# Altium schematic sheet ASIC_test_fanout.SchDoc
size A3; SheetNumber: 1; SheetTotal: 1
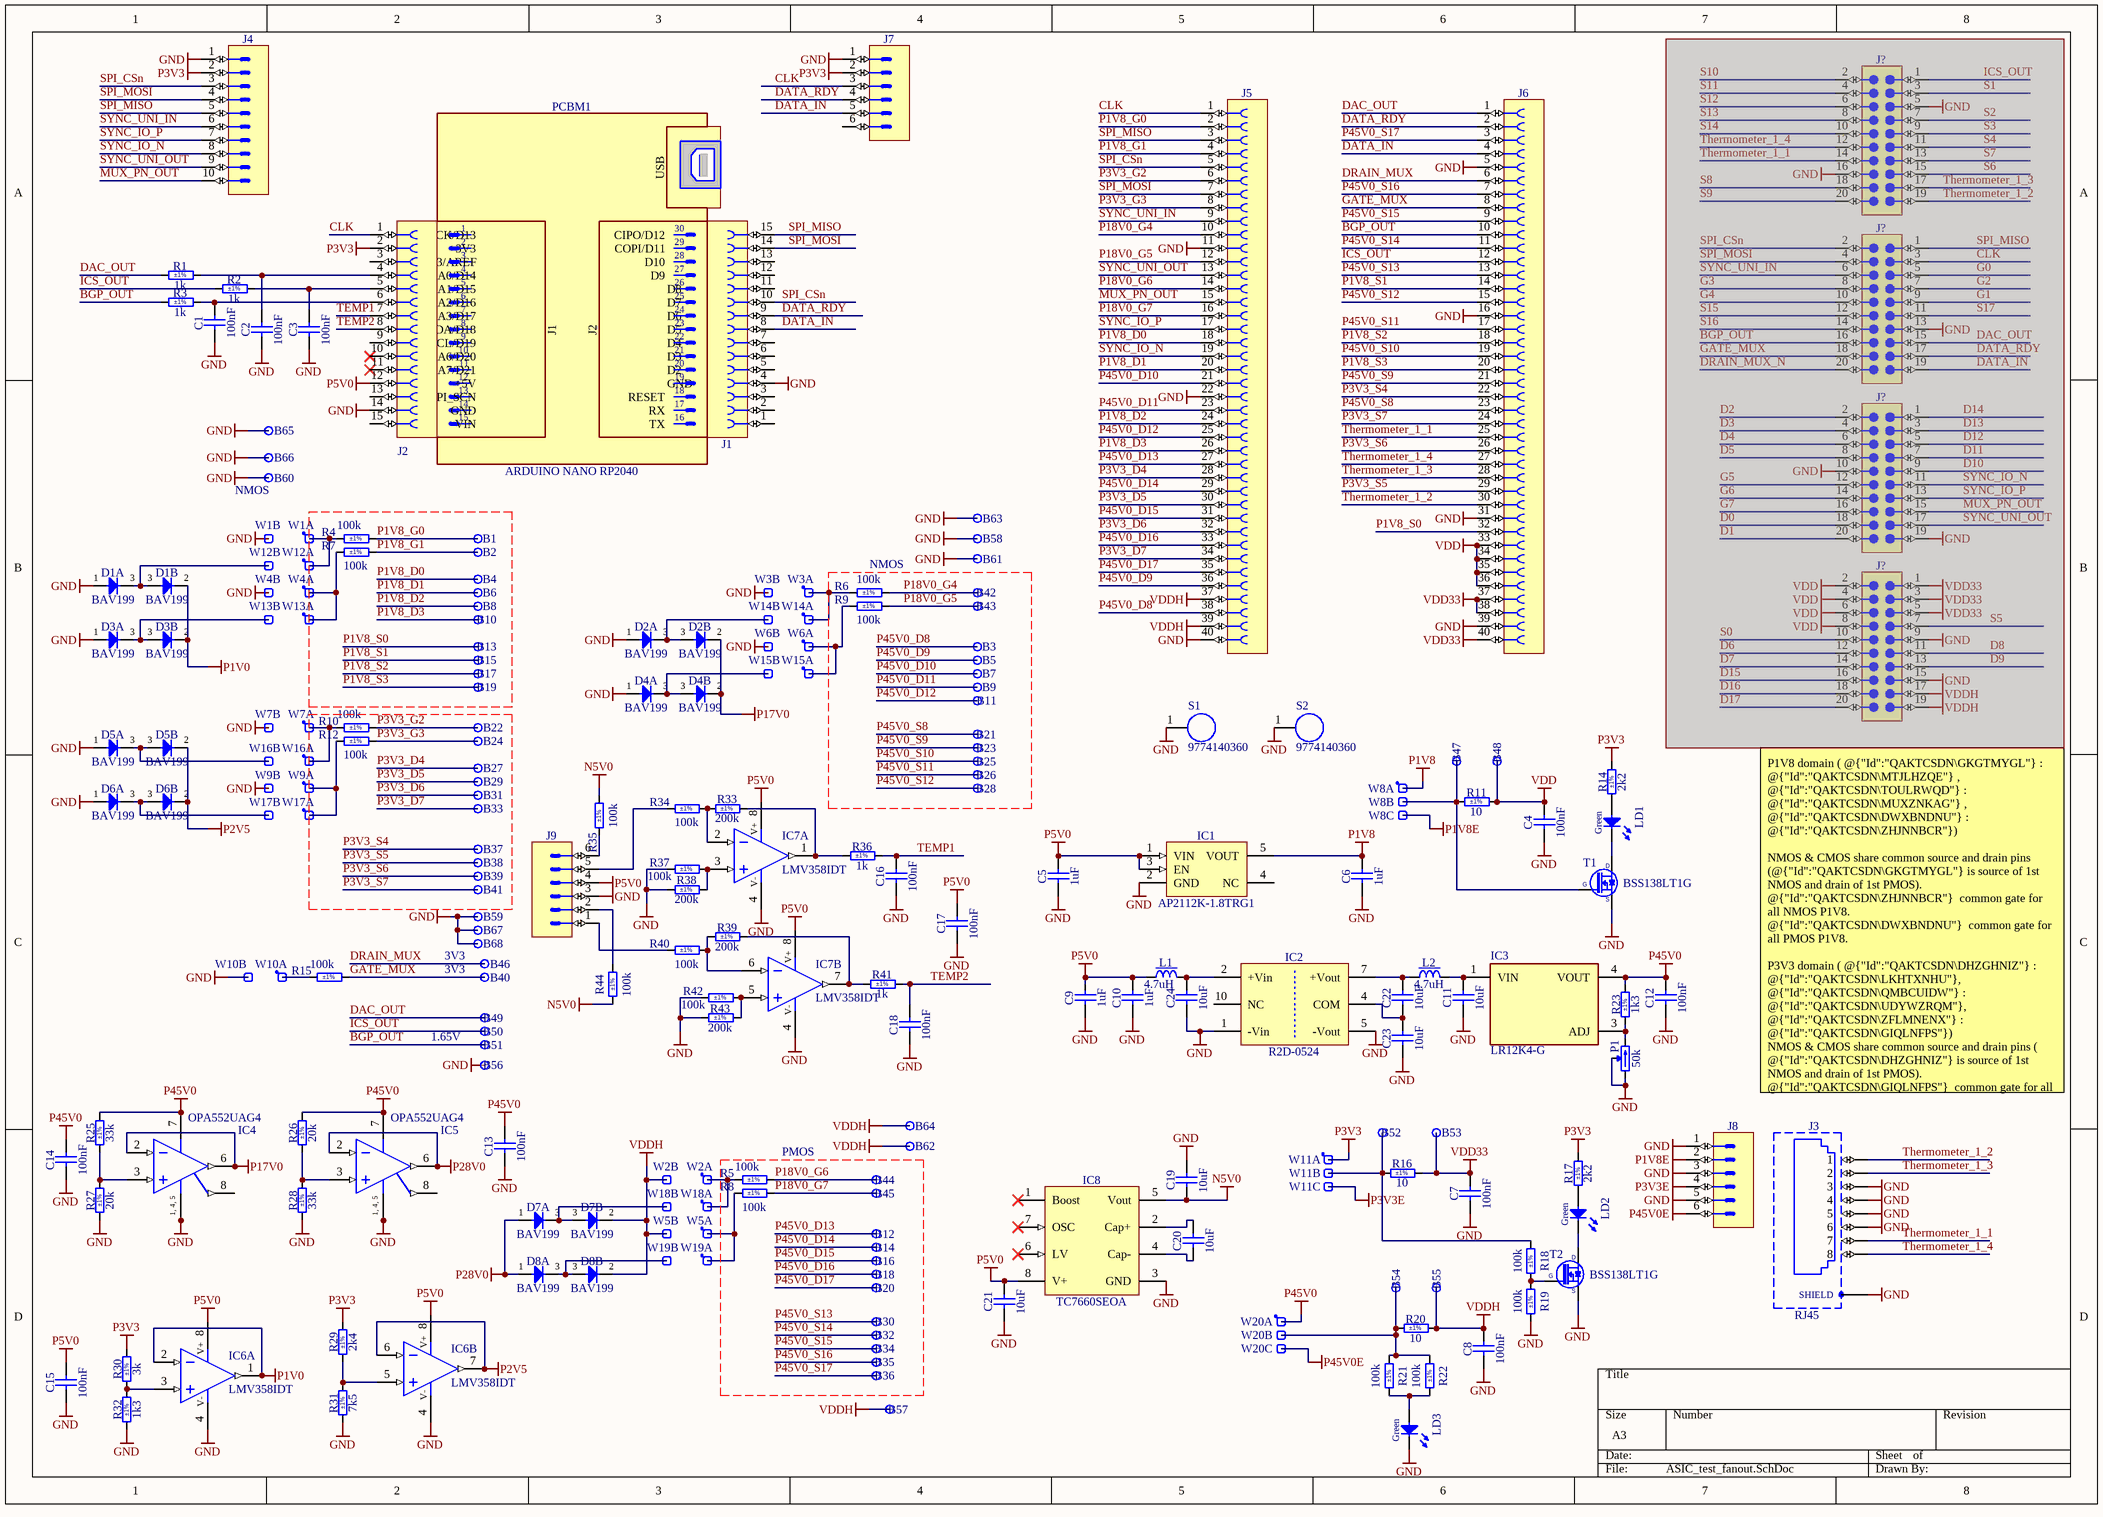
[diagram p0: ASIC_test_fanout.SchDoc]

## Parts
(Parts that share a designator on the sheet are numbered #1, #2 ... from top to bottom, then left to right.)
B1  Socket  [MULTI-CONTACT_23.1000]  (value not drawn)
B2  Socket  [MULTI-CONTACT_23.1000]  (value not drawn)
B3  Socket  [MULTI-CONTACT_23.1000]  (value not drawn)
B4  Socket  [MULTI-CONTACT_23.1000]  (value not drawn)
B5  Socket  [MULTI-CONTACT_23.1000]  (value not drawn)
B6  Socket  [MULTI-CONTACT_23.1000]  (value not drawn)
B7  Socket  [MULTI-CONTACT_23.1000]  (value not drawn)
B8  Socket  [MULTI-CONTACT_23.1000]  (value not drawn)
B9  Socket  [MULTI-CONTACT_23.1000]  (value not drawn)
B10  Socket  [MULTI-CONTACT_23.1000]  (value not drawn)
B11  Socket  [MULTI-CONTACT_23.1000]  (value not drawn)
B12  Socket  [MULTI-CONTACT_23.1000]  (value not drawn)
B13  Socket  [MULTI-CONTACT_23.1000]  (value not drawn)
B14  Socket  [MULTI-CONTACT_23.1000]  (value not drawn)
B15  Socket  [MULTI-CONTACT_23.1000]  (value not drawn)
B16  Socket  [MULTI-CONTACT_23.1000]  (value not drawn)
B17  Socket  [MULTI-CONTACT_23.1000]  (value not drawn)
B18  Socket  [MULTI-CONTACT_23.1000]  (value not drawn)
B19  Socket  [MULTI-CONTACT_23.1000]  (value not drawn)
B20  Socket  [MULTI-CONTACT_23.1000]  (value not drawn)
B21  Socket  [MULTI-CONTACT_23.1000]  (value not drawn)
B22  Socket  [MULTI-CONTACT_23.1000]  (value not drawn)
B23  Socket  [MULTI-CONTACT_23.1000]  (value not drawn)
B24  Socket  [MULTI-CONTACT_23.1000]  (value not drawn)
B25  Socket  [MULTI-CONTACT_23.1000]  (value not drawn)
B26  Socket  [MULTI-CONTACT_23.1000]  (value not drawn)
B27  Socket  [MULTI-CONTACT_23.1000]  (value not drawn)
B28  Socket  [MULTI-CONTACT_23.1000]  (value not drawn)
B29  Socket  [MULTI-CONTACT_23.1000]  (value not drawn)
B30  Socket  [MULTI-CONTACT_23.1000]  (value not drawn)
B31  Socket  [MULTI-CONTACT_23.1000]  (value not drawn)
B32  Socket  [MULTI-CONTACT_23.1000]  (value not drawn)
B33  Socket  [MULTI-CONTACT_23.1000]  (value not drawn)
B34  Socket  [MULTI-CONTACT_23.1000]  (value not drawn)
B35  Socket  [MULTI-CONTACT_23.1000]  (value not drawn)
B36  Socket  [MULTI-CONTACT_23.1000]  (value not drawn)
B37  Socket  [MULTI-CONTACT_23.1000]  (value not drawn)
B38  Socket  [MULTI-CONTACT_23.1000]  (value not drawn)
B39  Socket  [MULTI-CONTACT_23.1000]  (value not drawn)
B40  Socket  [MULTI-CONTACT_23.1000]  (value not drawn)
B41  Socket  [MULTI-CONTACT_23.1000]  (value not drawn)
B42  Socket  [MULTI-CONTACT_23.1000]  (value not drawn)
B43  Socket  [MULTI-CONTACT_23.1000]  (value not drawn)
B44  Socket  [MULTI-CONTACT_23.1000]  (value not drawn)
B45  Socket  [MULTI-CONTACT_23.1000]  (value not drawn)
B46  Socket  [MULTI-CONTACT_23.1000]  (value not drawn)
B47  Socket  [MULTI-CONTACT_23.1000]  (value not drawn)
B48  Socket  [MULTI-CONTACT_23.1000]  (value not drawn)
B49  Socket  [MULTI-CONTACT_23.1000]  (value not drawn)
B50  Socket  [MULTI-CONTACT_23.1000]  (value not drawn)
B51  Socket  [MULTI-CONTACT_23.1000]  (value not drawn)
B52  Socket  [MULTI-CONTACT_23.1000]  (value not drawn)
B53  Socket  [MULTI-CONTACT_23.1000]  (value not drawn)
B54  Socket  [MULTI-CONTACT_23.1000]  (value not drawn)
B55  Socket  [MULTI-CONTACT_23.1000]  (value not drawn)
B56  Socket  [MULTI-CONTACT_23.1000]  (value not drawn)
B57  Socket  [MULTI-CONTACT_23.1000]  (value not drawn)
B58  Socket  [MULTI-CONTACT_23.1000]  (value not drawn)
B59  Socket  [MULTI-CONTACT_23.1000]  (value not drawn)
B60  Socket  [MULTI-CONTACT_23.1000]  (value not drawn)
B61  Socket  [MULTI-CONTACT_23.1000]  (value not drawn)
B62  Socket  [MULTI-CONTACT_23.1000]  (value not drawn)
B63  Socket  [MULTI-CONTACT_23.1000]  (value not drawn)
B64  Socket  [MULTI-CONTACT_23.1000]  (value not drawn)
B65  Socket  [MULTI-CONTACT_23.1000]  (value not drawn)
B66  Socket  [MULTI-CONTACT_23.1000]  (value not drawn)
B67  Socket  [MULTI-CONTACT_23.1000]  (value not drawn)
B68  Socket  [MULTI-CONTACT_23.1000]  (value not drawn)
C1  100nF  [CAPC1608X87N]
C2  100nF  [CAPC1608X87N]
C3  100nF  [CAPC1608X87N]
C4  100nF  [CAPC1608X87N]
C5  1uF  [CAPC1608X87N]
C6  1uF  [CAPC1608X87N]
C7  100nF  [CAPC1608X87N]
C8  100nF  [CAPC1608X87N]
C9  1uF  [CAPC1608X87N]
C10  1uF  [CAPC1608X87N]
C11  10uF  [CAPC3216X180N]
C12  100nF  [CAPC1608X87N]
C13  100nF  [CAPC1608X87N]
C14  100nF  [CAPC1608X87N]
C15  100nF  [CAPC1608X87N]
C16  100nF  [CAPC1608X87N]
C17  100nF  [CAPC1608X87N]
C18  100nF  [CAPC1608X87N]
C19  10uF  [CAPC3216X180N]
C20  10uF  [CAPC3216X180N]
C21  10uF  [CAPC3216X180N]
C22  10uF  [CAPC3216X180N]
C23  10uF  [CAPC3216X180N]
C24  10uF  [CAPC3216X180N]
D1  BAV199  [SOT95P240X110-3N]  (parts A,B of 2)
D2  BAV199  [SOT95P240X110-3N]  (parts A,B of 2)
D3  BAV199  [SOT95P240X110-3N]  (parts A,B of 2)
D4  BAV199  [SOT95P240X110-3N]  (parts A,B of 2)
D5  BAV199  [SOT95P240X110-3N]  (parts A,B of 2)
D6  BAV199  [SOT95P240X110-3N]  (parts A,B of 2)
D7  BAV199  [SOT95P240X110-3N]  (parts A,B of 2)
D8  BAV199  [SOT95P240X110-3N]  (parts A,B of 2)
IC1  AP2112K-1.8TRG1  [SOT95P285X140-5N]
IC2  R2D-0524  [DCDC_RECOM_R2D]
IC3  LR12K4-G  [FP-C04-189-MFG]
IC4  OPA552UAG4  [TI-D8_N]
IC5  OPA552UAG4  [TI-D8_N]
IC6  LMV358IDT  [SOIC127P600X175-8N]  (parts A,B of 2)
IC7  LMV358IDT  [SOIC127P600X175-8N]  (parts A,B of 2)
IC8  TC7660SEOA  [SOIC127P600X175-8N]
J1  Socket 15  [SAMTEC_SSW-115-01-X-S]  (value not drawn)
J2  Socket 15  [SAMTEC_SSW-115-01-X-S]  (value not drawn)
J3  RJ45  [TYCO_6368150-1]
J4  Header 10  [SAMTEC_HTSW-105-23-L-D]  (value not drawn)
J5  Socket 40  [SAMTEC_RSM-120-02-L-D-K-TR]  (value not drawn)
J6  Socket 40  [SAMTEC_RSM-120-02-L-D-K-TR]  (value not drawn)
J7  Header 6  [SAMTEC_HTSW-106-23-L-S]  (value not drawn)
J8  (no value)  [PHOENIX_1803316]
J9  Header 6  [SAMTEC_HTSW-106-23-L-S]  (value not drawn)
J?#1  Header 20  [3M_45220-600230]  (value not drawn)  (masked out: inside a compile mask, not in the netlist)
J?#2  Header 20  [3M_45220-600230]  (value not drawn)  (masked out: inside a compile mask, not in the netlist)
J?#3  Header 20  [3M_45220-600230]  (value not drawn)  (masked out: inside a compile mask, not in the netlist)
J?#4  Header 20  [3M_45220-600230]  (value not drawn)  (masked out: inside a compile mask, not in the netlist)
L1  4.7uH  [IND_WURTH_WE-SPC-4838]
L2  4.7uH  [IND_WURTH_WE-SPC-4838]
LD1  Green  [LED_KINGBRIGHT_KP-1608CGCK]
LD2  Green  [LED_KINGBRIGHT_KP-1608CGCK]
LD3  Green  [LED_KINGBRIGHT_KP-1608CGCK]
P1  50k  [TRIM_BOURNS_3266W]
PCBM1  ARDUINO NANO RP2040  [PCBM_ARDUINO NANO RP2040]
R1  1k  Tolerance: ±1%  [RESC2012X60N]
R2  1k  Tolerance: ±1%  [RESC2012X60N]
R3  1k  Tolerance: ±1%  [RESC2012X60N]
R4  100k  Tolerance: ±1%  [RESC2012X60N]
R5  100k  Tolerance: ±1%  [RESC2012X60N]
R6  100k  Tolerance: ±1%  [RESC2012X60N]
R7  100k  Tolerance: ±1%  [RESC2012X60N]
R8  100k  Tolerance: ±1%  [RESC2012X60N]
R9  100k  Tolerance: ±1%  [RESC2012X60N]
R10  100k  Tolerance: ±1%  [RESC2012X60N]
R11  10  Tolerance: ±1%  [RESC2012X60N]
R12  100k  Tolerance: ±1%  [RESC2012X60N]
R14  2k2  Tolerance: ±1%  [RESC1608X55N]
R15  100k  Tolerance: ±1%  [RESC2012X60N]
R16  10  Tolerance: ±1%  [RESC2012X60N]
R17  2k2  Tolerance: ±1%  [RESC1608X55N]
R18  100k  Tolerance: ±1%  [RESC2012X60N]
R19  100k  Tolerance: ±1%  [RESC2012X60N]
R20  10  Tolerance: ±1%  [RESC2012X60N]
R21  100k  Tolerance: ±1%  [RESC2012X60N]
R22  100k  Tolerance: ±1%  [RESC2012X60N]
R23  1k3  Tolerance: ±1%  [RESC1608X55N]
R25  33k  Tolerance: ±1%  [RESC1608X55N]
R26  20k  Tolerance: ±1%  [RESC1608X55N]
R27  20k  Tolerance: ±1%  [RESC1608X55N]
R28  33k  Tolerance: ±1%  [RESC1608X55N]
R29  2k4  Tolerance: ±1%  [RESC1608X55N]
R30  3k  Tolerance: ±1%  [RESC1608X55N]
R31  7k5  Tolerance: ±1%  [RESC1608X55N]
R32  1k3  Tolerance: ±1%  [RESC1608X55N]
R33  200k  Tolerance: ±1%  [RESC1608X55N]
R34  100k  Tolerance: ±1%  [RESC2012X60N]
R35  100k  Tolerance: ±1%  [RESC2012X60N]
R36  1k  Tolerance: ±1%  [RESC2012X60N]
R37  100k  Tolerance: ±1%  [RESC2012X60N]
R38  200k  Tolerance: ±1%  [RESC1608X55N]
R39  200k  Tolerance: ±1%  [RESC1608X55N]
R40  100k  Tolerance: ±1%  [RESC2012X60N]
R41  1k  Tolerance: ±1%  [RESC2012X60N]
R42  100k  Tolerance: ±1%  [RESC2012X60N]
R43  200k  Tolerance: ±1%  [RESC1608X55N]
R44  100k  Tolerance: ±1%  [RESC2012X60N]
S1  9774140360  [9774140360]
S2  9774140360  [9774140360]
T1  BSS138LT1G  [SOT95P240X110-3N]
T2  BSS138LT1G  [SOT95P240X110-3N]
W1  Header 2  [SAMTEC_HTSW-102-23-L-S]  (value not drawn)  (parts A,B of 2)
W2  Header 2  [SAMTEC_HTSW-102-23-L-S]  (value not drawn)  (parts A,B of 2)
W3  Header 2  [SAMTEC_HTSW-102-23-L-S]  (value not drawn)  (parts A,B of 2)
W4  Header 2  [SAMTEC_HTSW-102-23-L-S]  (value not drawn)  (parts A,B of 2)
W5  Header 2  [SAMTEC_HTSW-102-23-L-S]  (value not drawn)  (parts A,B of 2)
W6  Header 2  [SAMTEC_HTSW-102-23-L-S]  (value not drawn)  (parts A,B of 2)
W7  Header 2  [SAMTEC_HTSW-102-23-L-S]  (value not drawn)  (parts A,B of 2)
W8  Header 3  [SAMTEC_HTSW-103-23-L-S]  (value not drawn)  (parts A,B,C of 3)
W9  Header 2  [SAMTEC_HTSW-102-23-L-S]  (value not drawn)  (parts A,B of 2)
W10  Header 2  [SAMTEC_HTSW-102-23-L-S]  (value not drawn)  (parts A,B of 2)
W11  Header 3  [SAMTEC_HTSW-103-23-L-S]  (value not drawn)  (parts A,B,C of 3)
W12  Header 2  [SAMTEC_HTSW-102-23-L-S]  (value not drawn)  (parts A,B of 2)
W13  Header 2  [SAMTEC_HTSW-102-23-L-S]  (value not drawn)  (parts A,B of 2)
W14  Header 2  [SAMTEC_HTSW-102-23-L-S]  (value not drawn)  (parts A,B of 2)
W15  Header 2  [SAMTEC_HTSW-102-23-L-S]  (value not drawn)  (parts A,B of 2)
W16  Header 2  [SAMTEC_HTSW-102-23-L-S]  (value not drawn)  (parts A,B of 2)
W17  Header 2  [SAMTEC_HTSW-102-23-L-S]  (value not drawn)  (parts A,B of 2)
W18  Header 2  [SAMTEC_HTSW-102-23-L-S]  (value not drawn)  (parts A,B of 2)
W19  Header 2  [SAMTEC_HTSW-102-23-L-S]  (value not drawn)  (parts A,B of 2)
W20  Header 3  [SAMTEC_HTSW-103-23-L-S]  (value not drawn)  (parts A,B,C of 3)

## Nets
GND: B56.1 B58.1 B59.1 B60.1 B61.1 B63.1 B65.1 B66.1 B67.1 B68.1 C1.1 C2.1 C3.1 C4.1 C5.1 C6.1 C7.1 C8.1 C9.1 C10.1 C11.1 C12.1 C13.1 C14.1 C15.1 C16.1 C17.1 C18.1 C19.2 C21.1 C23.1 C24.1 D1.1(A) D2.1(A) D3.1(A) D4.1(A) D5.1(A) D6.1(A) IC1.2(GND) IC2.1(-Vin) IC2.5(-Vout) IC4.1(V-) IC4.4(V-) IC4.5(V-) IC5.1(V-) IC5.4(V-) IC5.5(V-) IC6.4(V-) IC7.4(V-) IC8.3(GND) J1.4 J2.14 J3.3 J3.4 J3.5 J3.6 J3.SHIELD J4.1 J5.11 J5.22 J5.40 J6.5 J6.16 J6.31 J6.39 J7.1 J8.1 J8.3 J8.5 J9.3 LD3.1(C) P1.1(CCW) P1.2(W) R19.1 R27.1 R28.1 R31.1 R32.1 R37.1 R38.1 R42.1 R43.1 S1.1 S2.1 T1.2(S) T2.2(S) W1.2 W3.2 W4.2 W6.2 W7.2 W9.2 W10.2
N5V0: C19.1 IC8.5(Vout) R35.2 R44.1
P1V0: D1.2(C) D3.2(C) IC6.1(OUT) IC6.2(IN-)
P1V8: C6.2 IC1.5(VOUT) W8.1
P1V8E: J8.2 W8.3
P2V5: D5.2(C) D6.2(C) IC6.6(IN-) IC6.7(OUT)
P3V3: J2.2 J4.2 J7.2 R14.2 R17.2 R29.2 R30.2 W11.1
P3V3E: J8.4 W11.3
P5V0: C5.2 C9.2 C10.2 C15.2 C17.2 C21.2 IC1.1(VIN) IC1.3(EN) IC6.8(V+) IC7.8(V+) IC8.8(V+) J2.12 J9.4 L1.1
P17V0: D2.2(C) D4.2(C) IC4.2(IN-) IC4.6(OUT)
P28V0: D7.1(A) D8.1(A) IC5.2(IN-) IC5.6(OUT)
P45V0: C12.2 C13.2 C14.2 IC3.4(VOUT) IC4.7(V+) IC5.7(V+) R23.2 R25.2 R26.2 W20.1
P45V0E: J8.6 W20.3
VDD: B48.1 C4.2 J6.33 J6.34 J6.35 J6.36 R11.2
VDD33: B53.1 C7.2 J6.37 J6.38 J6.40 R16.2
VDDH: B55.1 B57.1 B62.1 B64.1 C8.2 D7.2(C) D8.2(C) J5.37 J5.39 R20.2 W2.2 W5.2
BGP_OUT: B51.1 J6.10 R3.1
CLK: J2.1 J5.1 J7.3
DAC_OUT: B49.1 J6.1 R1.1
DATA_IN: J1.8 J6.4 J7.5
DATA_RDY: J1.9 J6.2 J7.4
DRAIN_MUX: B46.1 J6.6
GATE_MUX: B40.1 J6.8 R15.2
ICS_OUT: B50.1 J6.12 R2.1
MUX_PN_OUT: J4.10 J5.15
P1V8_D0: B4.1 J5.18
P1V8_D1: B6.1 J5.20
P1V8_D2: B8.1 J5.24
P1V8_D3: B10.1 J5.26
P1V8_G0: B1.1 J5.2 R4.2
P1V8_G1: B2.1 J5.4 R7.2
P1V8_S0: B13.1 J6.32
P1V8_S1: B15.1 J6.14
P1V8_S2: B17.1 J6.18
P1V8_S3: B19.1 J6.20
P3V3_D4: B27.1 J5.28
P3V3_D5: B29.1 J5.30
P3V3_D6: B31.1 J5.32
P3V3_D7: B33.1 J5.34
P3V3_G2: B22.1 J5.6 R10.2
P3V3_G3: B24.1 J5.8 R12.2
P3V3_S4: B37.1 J6.22
P3V3_S5: B38.1 J6.29
P3V3_S6: B39.1 J6.26
P3V3_S7: B41.1 J6.24
P18V0_G4: B42.1 J5.10 R6.2
P18V0_G5: B43.1 J5.12 R9.2
P18V0_G6: B44.1 J5.14 R5.2
P18V0_G7: B45.1 J5.16 R8.2
P45V0_D8: B3.1 J5.38
P45V0_D9: B5.1 J5.36
P45V0_D10: B7.1 J5.21
P45V0_D11: B9.1 J5.23
P45V0_D12: B11.1 J5.25
P45V0_D13: B12.1 J5.27
P45V0_D14: B14.1 J5.29
P45V0_D15: B16.1 J5.31
P45V0_D16: B18.1 J5.33
P45V0_D17: B20.1 J5.35
P45V0_S8: B21.1 J6.23
P45V0_S9: B23.1 J6.21
P45V0_S10: B25.1 J6.19
P45V0_S11: B26.1 J6.17
P45V0_S12: B28.1 J6.15
P45V0_S13: B30.1 J6.13
P45V0_S14: B32.1 J6.11
P45V0_S15: B34.1 J6.9
P45V0_S16: B35.1 J6.7
P45V0_S17: B36.1 J6.3
SPI_CSn: J1.10 J4.3 J5.5
SPI_MISO: J1.15 J4.5 J5.3
SPI_MOSI: J1.14 J4.4 J5.7
SYNC_IO_N: J4.8 J5.19
SYNC_IO_P: J4.7 J5.17
SYNC_UNI_IN: J4.6 J5.9
SYNC_UNI_OUT: J4.9 J5.13
TEMP1: C16.2 J2.7 R36.2
TEMP2: C18.2 J2.8 R41.2
Thermometer_1_1: J3.7 J6.25
Thermometer_1_2: J3.1 J6.30
Thermometer_1_3: J3.2 J6.28
Thermometer_1_4: J3.8 J6.27
NetB47_1: B47.1 R11.1 T1.1(G) W8.2
NetB52_1: B52.1 R16.1 R18.2 W11.2
NetB54_1: B54.1 R20.1 R21.2 R22.2 W20.2
NetC1_2: C1.2 J2.6 R3.2
NetC2_2: C2.2 J2.4 R1.2
NetC3_2: C3.2 J2.5 R2.2
NetC11_2: C11.2 IC3.1(VIN) L2.2
NetC20_1: C20.1 IC8.4(Cap-)
NetC20_2: C20.2 IC8.2(Cap+)
NetC22_1: C22.1 C23.2 IC2.4(COM)
NetC22_2: C22.2 IC2.7(+Vout) L2.1
NetC24_2: C24.2 IC2.2(+Vin) L1.2
NetD1_3: D1.3(COMAC) W12.2
NetD2_3: D2.3(COMAC) W14.2
NetD3_3: D3.3(COMAC) W13.2
NetD4_3: D4.3(COMAC) W15.2
NetD5_3: D5.3(COMAC) W16.2
NetD6_3: D6.3(COMAC) W17.2
NetD7_3: D7.3(COMAC) W18.2
NetD8_3: D8.3(COMAC) W19.2
NetIC3_3: IC3.3(ADJ) P1.3(CW) R23.1
NetIC4_3: IC4.3(IN+) R25.1 R27.2
NetIC5_3: IC5.3(IN+) R26.1 R28.2
NetIC6_3: IC6.3(IN+) R30.1 R32.2
NetIC6_5: IC6.5(IN+) R29.1 R31.2
NetIC7_1: IC7.1(OUT) R33.2 R36.1
NetIC7_2: IC7.2(IN-) R33.1 R34.2
NetIC7_3: IC7.3(IN+) R37.2 R38.2
NetIC7_5: IC7.5(IN+) R42.2 R43.2
NetIC7_6: IC7.6(IN-) R39.1 R40.2
NetIC7_7: IC7.7(OUT) R39.2 R41.1
NetJ9_1: J9.1 R40.1
NetJ9_2: J9.2 R44.2
NetJ9_5: J9.5 R34.1
NetJ9_6: J9.6 R35.1
NetLD1_1: LD1.1(C) T1.3(D)
NetLD1_2: LD1.2(A) R14.1
NetLD2_1: LD2.1(C) T2.3(D)
NetLD2_2: LD2.2(A) R17.1
NetLD3_2: LD3.2(A) R21.1 R22.1
NetR4_1: R4.1 W1.1 W12.1
NetR5_1: R5.1 W2.1 W18.1
NetR6_1: R6.1 W3.1 W14.1
NetR7_1: R7.1 W4.1 W13.1
NetR8_1: R8.1 W5.1 W19.1
NetR9_1: R9.1 W6.1 W15.1
NetR10_1: R10.1 W7.1 W16.1
NetR12_1: R12.1 W9.1 W17.1
NetR15_1: R15.1 W10.1
NetR18_1: R18.1 R19.2 T2.1(G)

Not connected (* = marked no-connect by the designer): IC1 4(NC); IC2 10(NC); IC4 8(FLAG); IC5 8(FLAG); IC8 1(Boost)* 6(LV)* 7(OSC)*; J1 1 2 3 5 6 7 11 12 13; J2 3 9 10* 11* 13 15; J7 6

## Notes on the sheet
- (near B60) NMOS
- NMOS
- 3V3
- 1.65V
- (near J?#4) P1V8 domain ( @{"Id":"QAKTCSDN\GKGTMYGL"} : @{"Id":"QAKTCSDN\MTJLHZQE"} , @{"Id":"QAKTCSDN\TOULRWQD"} : @{"Id":"QAKTCSDN\MUXZNKAG"} , @{"Id":"QAKTCSDN\DWXBNDNU"} : @{"Id":"QAKTCSDN\ZHJNNBCR"})
  NMOS & CMOS share common source and drain pins (@{"Id":"QAKTCSDN\GKGTMYGL"} is source of 1st NMOS and drain of 1st PMOS).
  @{"Id":"QAKTCSDN\ZHJNNBCR"}  common gate for all NMOS P1V8.
  @{"Id":"QAKTCSDN\DWXBNDNU"}  common gate for all PMOS P1V8.
  P3V3 domain ( @{"Id":"QAKTCSDN\DHZGHNIZ"} : @{"Id":"QAKTCSDN\LKHTXNHU"}, @{"Id":"QAKTCSDN\QMBCUIDW"} : @{"Id":"QAKTCSDN\UDYWZRQM"}, @{"Id":"QAKTCSDN\ZFLMNENX"} : @{"Id":"QAKTCSDN\GIQLNFPS"})
  NMOS & CMOS share common source and drain pins ( @{"Id":"QAKTCSDN\DHZGHNIZ"} is source of 1st NMOS and drain of 1st PMOS).
  @{"Id":"QAKTCSDN\GIQLNFPS"}  common gate for all NMOS P3V3.
  @{"Id":"QAKTCSDN\ZFLMNENX"}  common gate for all PMOS P1V8.
  P18V0 domain ( @{"Id":"QAKTCSDN\TCQKZZJW"} : @{"Id":"QAKTCSDN\IFVMLPFB"})
  Gates for CMOS in P45V0 domain.
  @{"Id":"QAKTCSDN\TCQKZZJW"}  Gate for first 5 NMOS
  @{"Id":"QAKTCSDN\BTYXEQQY"}  Gate for second 5 NMOS
  @{"Id":"QAKTCSDN\BTVZBPLE"}  Gate for first 5 PMOS
  @{"Id":"QAKTCSDN\IFVMLPFB"}  Gate for second 5 PMOS
  P45V0 domain ( @{"Id":"QAKTCSDN\KKAFSXUZ"} : @{"Id":"QAKTCSDN\VMRQOTMS"}, @{"Id":"QAKTCSDN\EVYYKNRE"} : @{"Id":"QAKTCSDN\AUFCYRPE"})
  Sources and drains for cmos:
  8-12: NMOS, 2 transistors per pin (different gate)
  13-17: PMOS, 2 transistors per pin (different gate)
- PMOS
- (in symbol CMP-0272-03269-2) 1, 4, 5
- (in symbol PCBM_ARDUINO NANO RP2040) USB; 1; 30; SCK/D13; CIPO/D12; 2; 29; +3V3; COPI/D11; 3; 28; PA03/AREF; D10; 4; 27; A0/D14; D9; 5; 26; A1/D15; D8; 6; 25; A2/D16; D7; 7; 24; A3/D17; D6; 8; 23; A4/SDA/D18; J1; J2; D5; 9; 22; A5/SCL/D19; D4; 10; 21; A6/D20; D3; 11; 20; A7/D21; D2; 12; 19; +5V; GND; 13; 18; QSPI_SCN; RESET; 14; 17; RX; 15; 16; VIN; TX

## Library data of the parts
B1-B68 = MULTI-CONTACT_23.1000: Single Terminal Socket; Part Description: Machined Brass Uninsulated Ø 2 mm Rigid Socket, LB2-A Type; PressFit: No; Part Number: MULTI-CONTACT_23.1000; Component Kind: Standard; Component Type: Standard; Pin Count: 1; Family: Socket; Mounted: Yes; Socket: No; SMD: No; Sense: No; Status: None; Manufacturer: MULTI-CONTACT; Manufacturer Part Number: 23.1000; ComponentHeight: 2mm; HelpURL: \\cern.ch\dfs\Applications\Altium\Datasheets\MULTI-CONTACT_23.1000.pdf; Author: CERN DEM JLC; CreateDate: 20.03.2012; LatestRevisionDate: 20.03.2012
C1-C4 C7 C8 C12-C18 = CC0603_100NF_50V_10%_X7R: Non-polarised capacitor; Part Description: SMD Multilayer Chip Ceramic Capacitor; Manufacturer: GENERIC; Manufacturer1 Part Number: 223858615649; Voltage: 50V; TC: X7R; Tolerance: ±10%; Part Number: CC0603_100NF_50V_10%_X7R; Component Kind: Standard; Component Type: Standard; Pin Count: 2; Value: 100nF; Status: Preferred; Manufacturer Part Number: CC0603_100NF_50V_10%_X7R; Case: 0603; Mounted: Yes; Socket: No; SMD: Yes; Sense: No; Manufacturer1 Example: PHYCOMP; Manufacturer1 ComponentHeight: 0.87mm; HelpURL: \\cern.ch\dfs\Applications\Altium\Datasheets\CC0603_X7R_PHYCOMP.pdf; Author: CERN DEM JLC; CreateDate: 03.12.2007; LatestRevisionDate: 03.12.2007
C5 C6 C9 C10 = CC0603_1UF_25V_10%_X7R: Non-polarised capacitor; Part Description: SMD Multilayer Chip Ceramic Capacitor; Manufacturer: GENERIC; Manufacturer1 Part Number: GRM188R71E105KA12D; Voltage: 25V; TC: X7R; Tolerance: ±10%; Part Number: CC0603_1UF_25V_10%_X7R; Component Kind: Standard; Component Type: Standard; Pin Count: 2; Value: 1uF; Status: None; Manufacturer Part Number: CC0603_1UF_25V_10%_X7R; Case: 0603; Mounted: Yes; Socket: No; SMD: Yes; Sense: No; Manufacturer1 Example: MURATA; Manufacturer1 ComponentHeight: 0.9mm; HelpURL: \\cern.ch\dfs\Applications\Altium\Datasheets\CC0603_X7R_MURATA.pdf; Author: CERN DEM JLC; CreateDate: 18.01.2011; LatestRevisionDate: 18.01.2011
C11 C19-C24 = CC1206_10UF_50V_10%_X5R: Non-polarised capacitor; Part Description: SMD Multilayer Chip Ceramic Capacitor; Manufacturer: GENERIC; Manufacturer1 Part Number: C3216X5R1H106K160; Voltage: 50V; TC: X5R; Tolerance: ±10%; Part Number: CC1206_10UF_50V_10%_X5R; Component Kind: Standard; Component Type: Standard; Pin Count: 2; Value: 10uF; Status: None; Manufacturer Part Number: CC1206_10UF_50V_10%_X5R; Case: 1206; Mounted: Yes; Socket: No; SMD: Yes; Sense: No; Manufacturer1 Example: TDK; Manufacturer1 ComponentHeight: 1.8mm; HelpURL: \\cern.ch\dfs\Applications\Altium\Datasheets\CC1206_X5R_TDK_C.pdf; Author: CERN DEM WB; CreateDate: 22.06.2021; LatestRevisionDate: 22.06.2021
D1-D8 = BAV199: Serial Diode; Part Description: Low-Leakage Double Diode; Manufacturer: NXP SEMICONDUCTORS; Voltage: 75V; Power: 250mW; PressFit: No; Bonding: No; Part Number: BAV199; Component Kind: Standard; Component Type: Standard; Device: BAV199; PackageDescription: SOT, 0.95mm Pitch; 3 Pin, 1.40mm W X 3.00mm L X 1.10mm H body, IPC Medium Density; Manufacturer Part Number: BAV199; Pin Count: 3; Case: SOT23-3; Mounted: Yes; Socket: No; SMD: Yes; Sense: No; ComponentHeight: 1.1mm; HelpURL: \\cern.ch\dfs\Applications\Altium\Datasheets\BAV199.pdf; Author: CERN DEM JMW; CreateDate: 21.11.2008; LatestRevisionDate: 21.11.2008
IC1 = AP2112K-1.8TRG1: 600mA CMOS Low Dropout Linear Regulator with Enable; Part Description: 1.8V 600mA CMOS Low Dropout Linear Regulator with Enable; Manufacturer: DIODES INCORPORATED; PressFit: No; Bonding: No; Part Number: AP2112K-1.8TRG1; Component Kind: Standard; Component Type: Standard; Device: AP2112K-1.8TRG1; PackageDescription: SOT23, 0.95mm Pitch; 5 Pin, 1.6mm W X 3.0mm L X 1.40mm H body, IPC Medium Density; Manufacturer Part Number: AP2112K-1.8; Pin Count: 5; Case: SOT25; Mounted: Yes; Socket: No; SMD: Yes; Sense: No; ComponentHeight: 1.4mm; HelpURL: \\cern.ch\dfs\Applications\Altium\Datasheets\AP2112K-1.8TRG1.pdf; Author: CERN DEM JLC; CreateDate: 13.06.2018; LatestRevisionDate: 27.06.2022
IC2 = RECOM_R2D: RECOM, R2D Series, Dual Output DCDC Converter; Part Description: 5VDC to ±24VDC, Iout ±42mA, 3kVDC Isolated, 2W DC-DC Converter; PressFit: No; Bonding: No; Part Number: RECOM_R2D; Component Kind: Standard; Component Type: Standard; Device: R2D-0524; PackageDescription: R2D Series 6 Pin of 10 SMD Package Version, DC/DC Converter,  Body 10.7X15.24mm; Manufacturer: RECOM; Manufacturer Part Number: R2D-0524; Pin Count: 6; Mounted: Yes; Socket: No; SMD: Yes; Sense: No; ComponentHeight: 9mm; HelpURL: \\cern.ch\dfs\Applications\Altium\Datasheets\R2D-0524.pdf; Author: CERN DEM JLC; CreateDate: 10.08.2017; LatestRevisionDate: 10.08.2017
IC3 = CMP-06324-000063-1: IC REG LIN POS ADJ 50MA TO252-3; Output Type: Adjustable; Polarity: Positive; Output Current: 100mA; Min Input Voltage: 13.2V; Number of Regulators: 1; Max Output Voltage: 88V; Power Supply Rejection Ratio (PSRR): 60dB; Max Power Dissipation: 2W; Min Output Voltage: 1.2V; Max Input Voltage: 100V; Accuracy: 5%; Package Quantity: 2000; Width: 6.1mm; Lead Free: Lead Free; Mount: Surface Mount; Max Operating Temperature: 85°C; Length: 6.73mm; Min Operating Temperature: -40°C; Series: -; Number of Pins: 3; Case/Package: TO-252-3; Packaging: Tape and Reel; Output Configuration: Positive; Output Voltage: 88V; Height: 2.39mm; Number of Outputs: 1
IC4 IC5 = CMP-0272-03269-2: High-Voltage, High-Current Operational Amplifier, 8 to 60 V, -55 to 125 degC, 8-pin SOIC (D8), Green (RoHS & no Sb/Br); Manufacturer: Texas Instruments; CMRR(Min)(dB): 92; Sub Family: High Output Current Amplifier (>=50mA), High Supply Voltage Amplifier (>=30V), Precision Amplifier; Rating: Catalog; Iq per channel(Max)(mA): 8.5; Total Supply Voltage(Min)(+5V is 5, +/-5V is 10): 8; IIB(Max)(pA): 100; Total Supply Voltage(Max)(+5V is 5, +/-5V is 10): 60; Packing: TUBE; Slew Rate(Typ)(V/us): 24; Offset Drift(Typ)(uV/C): 7; Number of Channels: 1; GBW(Typ)(MHz): 12; Vio (25C)(Max)(mV): 3; Code_JEDEC: MS-012; PackageReference: D8; ComponentLink3URL: http://www.ti.com/litv/pdf/msoi002j; ComponentLink1Description: Manufacturer URL; PackageDescription: 8-Pin Plastic Small Outline, Body 4.9 x 3.9 mm, Pitch 1.27 mm; Eco-Plan: Green (RoHS & no Sb/Br); PartNumber: OPA552UAG4; DatasheetVersion: SBOS100A; PackageVersion: 4040047-3/M, 06/2011; ComponentLink1URL: http://www.ti.com/; Mounting Technology: Surface Mount; ComponentLink2Description: Datasheet; ComponentLink2URL: http://www.ti.com/lit/ds/symlink/opa552.pdf; ComponentLink3Description: Package Specification
IC6 IC7 = LMV358IDT: Dual Operational Amplifier; Part Description: Dual General Purpose, Low Voltage, Tiny Pack Comparator; Manufacturer: ST MICROELECTRONICS; PressFit: No; Bonding: No; Part Number: LMV358IDT; Component Kind: Standard; Component Type: Standard; Device: LMV358IDT; PackageDescription: SOIC 8, Pitch 1.27mm - Body 4x5mm, IPC Medium Density; Manufacturer Part Number: LMV358IDT; Pin Count: 8; Case: SOIC8; Mounted: Yes; Socket: No; SMD: Yes; Sense: No; ComponentHeight: 1.75mm; Author: CERN DEM HF; HelpURL: \\cern.ch\dfs\Applications\Altium\Datasheets\LMV358.pdf; CreateDate: 21.12.2023; LatestRevisionDate: 21.12.2023
IC8 = TC7660SEOA: Super Charge Pump DC-to-DC Voltage Converter; Manufacturer: MICROCHIP TECHNOLOGY; PressFit: No; Bonding: No; Part Number: TC7660SEOA; Component Kind: Standard; Component Type: Standard; Device: TC7660SEOA; PackageDescription: SOIC 8, Pitch 1.27mm, Body 4x5mm, IPC Medium Density; Part Description: Super Charge Pump DC-to-DC Voltage Converter; Manufacturer Part Number: TC7660SEOA; Pin Count: 8; Case: SOIC8; Mounted: Yes; Socket: No; SMD: Yes; Sense: No; ComponentHeight: 1.75mm; HelpURL: \\cern.ch\dfs\Applications\Altium\Datasheets\TC7660S.pdf; Author: CERN DEM HF; CreateDate: 28.02.2024; LatestRevisionDate: 28.02.2024
J1 J2 = SAMTEC_SSW-115-01-T-S: Connector 15 Female; Part Description: 15 Contacts, Pitch 2.54mm, Single Row Through Mount Straight Socket (Lead Length 2.64mm); Manufacturer: SAMTEC; PressFit: No; Part Number: SAMTEC_SSW-115-01-T-S; Component Kind: Standard; Component Type: Standard; Pin Count: 15; Family: Socket 15; Mounted: Yes; Socket: No; SMD: No; Sense: No; Status: None; Manufacturer Part Number: SSW-115-01-T-S; ComponentHeight: 8.51mm; HelpURL: \\cern.ch\dfs\Applications\Altium\Datasheets\SAMTEC_SSW.pdf; Author: CERN DEM HF; CreateDate: 08.08.2023; LatestRevisionDate: 08.08.2023
J3 = TYCO_6368150-1: Connector RJ45 + Shield; Part Description: 1 Port, RJ45 Connector,  8 Positions, Shielded, Straight, Category 5; Manufacturer: TYCO ELECTRONICS; PressFit: No; Part Number: TYCO_6368150-1; Component Kind: Standard; Component Type: Standard; Pin Count: 10; Family: RJ45; Mounted: Yes; Socket: No; SMD: No; Sense: No; Status: None; Manufacturer Part Number: 6368150-1; ComponentHeight: 17.02mm; HelpURL: \\cern.ch\dfs\Applications\Altium\Datasheets\TYCO_6368150-1.pdf; Author: CERN DEM MR; CreateDate: 18.06.2019; LatestRevisionDate: 18.06.2019
J4 = SAMTEC_HTSW-105-23-L-D: Connector 10 Male; Part Description: 10 Contacts, Pitch 2.54mm, Dual Row Through Mount Straight Header (Post Lead 5.84mm, Tail Lead 2.92mm, Insulator 2.54mm); Manufacturer: SAMTEC; PressFit: No; Status Comment: High Temperature; Part Number: SAMTEC_HTSW-105-23-L-D; Component Kind: Standard; Component Type: Standard; Pin Count: 10; Family: Header 10; Mounted: Yes; Socket: No; SMD: No; Sense: No; Status: Preferred; Manufacturer Part Number: HTSW-105-23-L-D; ComponentHeight: 8.38mm; HelpURL: \\cern.ch\dfs\Applications\Altium\Datasheets\SAMTEC_HTSW-105-23-L-D.pdf; Author: CERN DEM JLC; CreateDate: 13.02.2018; LatestRevisionDate: 13.02.2018
J5 J6 = SAMTEC_RSM-120-02-L-D-K-TR: Connector 40 Female; Part Description: 40 Contacts, Pitch 1.27mm, Dual Row Straight SMD Micro Socket; Manufacturer: SAMTEC; PressFit: No; Part Number: SAMTEC_RSM-120-02-L-D-K-TR; Component Kind: Standard; Component Type: Standard; Pin Count: 40; Family: Socket 40; Mounted: Yes; Socket: No; SMD: Yes; Sense: No; Status: None; Manufacturer Part Number: RSM-120-02-L-D-K; ComponentHeight: 6.1mm; HelpURL: \\cern.ch\dfs\Applications\Altium\Datasheets\SAMTEC_RSM-120-02-L-D-K-TR.pdf; Author: CERN DEM JLC; CreateDate: 09.01.2013; LatestRevisionDate: 09.01.2023; System: Connector
J7 J9 = SAMTEC_HTSW-106-23-L-S: Connector 6 Male; Part Description: 6 Contacts, Pitch 2.54mm, Single Row Through Mount Straight Header (Post Lead = 5.84mm, Tail Lead 2.92mm, Insulator 2.54mm); Manufacturer: SAMTEC; PressFit: No; Status Comment: High Temperature; Part Number: SAMTEC_HTSW-106-23-L-S; Component Kind: Standard; Component Type: Standard; Pin Count: 6; Family: Header 6; Mounted: Yes; Socket: No; SMD: No; Sense: No; Status: Preferred; Manufacturer Part Number: HTSW-106-23-L-S; ComponentHeight: 8.38mm; HelpURL: \\cern.ch\dfs\Applications\Altium\Datasheets\SAMTEC_HTSW-106-23-L-S.pdf; Author: CERN DEM JLC; CreateDate: 22.02.2018; LatestRevisionDate: 22.02.2018
J8 = PHOENIX_1803316: Connector 6 Male; Part Description: 8A 160 V, Pitch: 3.81mm, 6 Positions  Right Angled Header; Manufacturer: PHOENIX CONTACT; Manufacturer Part Number: 1803316 (MC 1,5/ 6-G-3,81); PressFit: No; Part Number: PHOENIX_1803316; Component Kind: Standard; Component Type: Standard; Pin Count: 6; Mounted: Yes; Socket: No; SMD: No; Sense: No; Status: None; ComponentHeight: 7.25mm; HelpURL: \\cern.ch\dfs\Applications\Altium\Datasheets\PHOENIX_1803316.pdf; Author: CERN DEM JLC; CreateDate: 06.05.2014; LatestRevisionDate: 06.05.2014
J?#1-J?#4 = 3M_45220-600230: Connector 20 Male; Part Description: 20 Contacts - 1.27mm (0.050") Pitch - Shrouded Boardmount Vertical Header Without Latch/Ejectors, 452 Series; Manufacturer: 3M; PressFit: No; Part Number: 3M_45220-600230; Component Kind: Standard; Component Type: Standard; Pin Count: 20; Family: Header 20; Mounted: Yes; Socket: No; SMD: No; Sense: No; Status: None; Manufacturer Part Number: 45220-600230; ComponentHeight: 5.64mm; HelpURL: \\cern.ch\dfs\Applications\Altium\Datasheets\3M_45220-600230.pdf; Author: CERN DEM MR; CreateDate: 15.08.2019; LatestRevisionDate: 15.08.2019
L1 L2 = IND_4.7UH_20%_WURTH_WE-SPC_74408943047: Inductor With Core; Part Description: SMD Shielded Power Inductor (WE-SPC Series); Manufacturer: WURTH ELEKTRONIK; Power: 2.2A; Resistance: 0.045R; Tolerance: ±20%; Part Number: IND_4.7UH_20%_WURTH_WE-SPC_74408943047; Component Kind: Standard; Component Type: Standard; Pin Count: 2; Value: 4.7uH; Manufacturer Part Number: 74408943047; Mounted: Yes; Socket: No; SMD: Yes; Sense: No; ComponentHeight: 4.1mm; HelpURL: \\cern.ch\dfs\Applications\Altium\Datasheets\IND_WURTH_WE-SPC_74408943047.pdf; Author: CERN DEM JLC; CreateDate: 24.11.2014; LatestRevisionDate: 05.07.2017
LD1-LD3 = LED_KINGBRIGHT_KP-1608CGCK: LED Green 1C 2A; Part Description: 1.6x0.8mm SMD Chip Green LED Lamp; PressFit: No; Bonding: No; Part Number: LED_KINGBRIGHT_KP-1608CGCK; Component Kind: Standard; Component Type: Standard; Color: Green; PackageDescription: SMT Green LED, Case 0603, Body L 1.60mm x W 0.80mm x H 1.10mm; Manufacturer: KINGBRIGHT; Manufacturer Part Number: KP-1608CGCK; Pin Count: 2; Case: 0603; Mounted: Yes; Socket: No; SMD: Yes; Sense: No; ComponentHeight: 1.1mm; HelpURL: \\cern.ch\dfs\Applications\Altium\Datasheets\LED_KINGBRIGHT_KP-1608CGCK.pdf; Author: CERN DEM HF; CreateDate: 01.10.2021; LatestRevisionDate: 01.10.2021
P1 = TRIM_12T_50K_BOURNS_3266W-1-503LF: Trimming Potentiometer; Part Description: 12 Turn Trimming Potentiometer (Top Adjustment); Manufacturer: BOURNS; Power: 0.25W; TC: ±100ppm/°C; Tolerance: ±10%; PressFit: No; Part Number: TRIM_12T_50K_BOURNS_3266W-1-503LF; Component Kind: Standard; Component Type: Standard; Pin Count: 3; Value: 50k; Manufacturer Part Number: 3266W-1-503LF; Case: 3266W; Mounted: Yes; Socket: No; SMD: No; Sense: No; ComponentHeight: 7.75mm; HelpURL: \\cern.ch\dfs\Applications\Altium\Datasheets\TRIM_BOURNS_3266W.pdf; Author: CERN DEM JMW; CreateDate: 29.07.2009; LatestRevisionDate: 28.11.2012
PCBM1 = PCBM_ARDUINO NANO RP2040: Arduino NANO Printed Circuit Board Module; Part Description: Arduino NANO RP2040 Printed Circuit Board Module; PressFit: No; Bonding: No; Part Number: PCBM_ARDUINO NANO RP2040; Component Kind: Accessories; Component Type: Standard; Device: ARDUINO NANO RP2040; PackageDescription: Microcontroller Board Arduino NANO RP2040; Manufacturer: ARDUINO; Manufacturer Part Number: ARDUINO NANO RP2040; Pin Count: 0; Mounted: Yes; Socket: No; SMD: No; Sense: No; ComponentHeight: 15.4mm; Author: CERN DEM HF; HelpURL: \\cern.ch\dfs\Applications\Altium\Datasheets\PCBM_ARDUINO NANO RP2040.pdf; CreateDate: 06.09.2022; LatestRevisionDate: 06.09.2022
R1-R3 R36 R41 = R0805_1K_1%_0.5W_100PPM_VISHAY_CRCW-HP e3: Resistor - 1%; Part Description: 150V, Pulse Proof, High Power Thick Film Chip Resistor; Manufacturer: VISHAY DRALORIC; Manufacturer Part Number: CRCW08051K00FKEAHP; Manufacturer1 Part Number: VISHAY; Power: 0.33W; TC: ±100ppm/°C; PressFit: No; Part Number: R0805_1K_1%_0.5W_100PPM_VISHAY_CRCW-HP e3; Component Kind: Standard; Component Type: Standard; Pin Count: 2; Value: 1k; Status: None; Case: 0805; Mounted: Yes; Sense: No; Socket: No; SMD: Yes; Manufacturer1 ComponentHeight: 0.6mm; HelpURL: \\cern.ch\dfs\Applications\Altium\Datasheets\R0805_VISHAY_CRCW-HP e3.pdf; Author: CERN DEM JLC; CreateDate: 16.06.2010; LatestRevisionDate: 16.06.2010
R4-R10 R12 R15 R18 R19 R21 R22 R34 R35 R37 R40 R42 R44 = R0805_100K_1%_0.125W_100PPM: Resistor - 1%; Part Description: General Purpose Thick Film Chip Resistor; Manufacturer: GENERIC; Manufacturer1 Part Number: NRC10F1003TRF; Power: 0.125W; TC: ±100ppm/°C; PressFit: No; Part Number: R0805_100K_1%_0.125W_100PPM; Component Kind: Standard; Component Type: Standard; Pin Count: 2; Value: 100k; Status: Preferred; Manufacturer Part Number: R0805_100K_1%_0.125W_100PPM; Case: 0805; Mounted: Yes; Sense: No; Socket: No; SMD: Yes; Manufacturer1 Example: NIC COMPONENT; Manufacturer1 ComponentHeight: 0.6mm; HelpURL: \\cern.ch\dfs\Applications\Altium\Datasheets\R0805_NIC_NRC.pdf; Author: CERN DEM JLC; CreateDate: 03.12.2007; LatestRevisionDate: 13.03.2008
R11 R16 R20 = R0805_10R_1%_0.125W_200PPM: Resistor - 1%; Part Description: General Purpose Thick Film Chip Resistor; Manufacturer: GENERIC; Manufacturer1 Part Number: NRC10F10R0TRF; Power: 0.125W; TC: ±200ppm/°C; PressFit: No; Part Number: R0805_10R_1%_0.125W_200PPM; Component Kind: Standard; Component Type: Standard; Pin Count: 2; Value: 10; Status: Preferred; Manufacturer Part Number: R0805_10R_1%_0.125W_200PPM; Case: 0805; Mounted: Yes; Sense: No; Socket: No; SMD: Yes; Manufacturer1 Example: NIC COMPONENT; Manufacturer1 ComponentHeight: 0.6mm; HelpURL: \\cern.ch\dfs\Applications\Altium\Datasheets\R0805_NIC_NRC.pdf; Author: CERN DEM JLC; CreateDate: 03.12.2007; LatestRevisionDate: 24.06.2009
R14 R17 = R0603_2K2_1%_0.1W_100PPM: Resistor - 1%; Part Description: General Purpose Thick Film Chip Resistor; Manufacturer: GENERIC; Manufacturer1 Part Number: NRC06F2201TRF; Power: 0.1W; TC: ±100ppm/°C; PressFit: No; Part Number: R0603_2K2_1%_0.1W_100PPM; Component Kind: Standard; Component Type: Standard; Pin Count: 2; Value: 2k2; Status: Preferred; Manufacturer Part Number: R0603_2K2_1%_0.1W_100PPM; Case: 0603; Mounted: Yes; Sense: No; Socket: No; SMD: Yes; Manufacturer1 Example: NIC COMPONENT; Manufacturer1 ComponentHeight: 0.55mm; HelpURL: \\cern.ch\dfs\Applications\Altium\Datasheets\R0603_NIC_NRC.pdf; Author: CERN DEM JLC; CreateDate: 03.12.2007; LatestRevisionDate: 13.03.2008
R23 R32 = R0603_1K3_1%_0.1W_100PPM: Resistor - 1%; Part Description: General Purpose Thick Film Chip Resistor; Manufacturer: GENERIC; Manufacturer1 Part Number: NRC06F1301TRF; Power: 0.1W; TC: ±100ppm/°C; PressFit: No; Part Number: R0603_1K3_1%_0.1W_100PPM; Component Kind: Standard; Component Type: Standard; Pin Count: 2; Value: 1k3; Status: Preferred; Manufacturer Part Number: R0603_1K3_1%_0.1W_100PPM; Case: 0603; Mounted: Yes; Sense: No; Socket: No; SMD: Yes; Manufacturer1 Example: NIC COMPONENT; Manufacturer1 ComponentHeight: 0.55mm; HelpURL: \\cern.ch\dfs\Applications\Altium\Datasheets\R0603_NIC_NRC.pdf; Author: CERN DEM JLC; CreateDate: 03.12.2007; LatestRevisionDate: 13.03.2008
R25 R28 = R0603_33K_1%_0.1W_100PPM: Resistor - 1%; Part Description: General Purpose Thick Film Chip Resistor; Manufacturer: GENERIC; Manufacturer1 Part Number: NRC06F3302TRF; Power: 0.1W; TC: ±100ppm/°C; PressFit: No; Part Number: R0603_33K_1%_0.1W_100PPM; Component Kind: Standard; Component Type: Standard; Pin Count: 2; Value: 33k; Status: Preferred; Manufacturer Part Number: R0603_33K_1%_0.1W_100PPM; Case: 0603; Mounted: Yes; Sense: No; Socket: No; SMD: Yes; Manufacturer1 Example: NIC COMPONENT; Manufacturer1 ComponentHeight: 0.55mm; HelpURL: \\cern.ch\dfs\Applications\Altium\Datasheets\R0603_NIC_NRC.pdf; Author: CERN DEM JLC; CreateDate: 03.12.2007; LatestRevisionDate: 13.03.2008
R26 R27 = R0603_20K_1%_0.1W_100PPM: Resistor - 1%; Part Description: General Purpose Thick Film Chip Resistor; Manufacturer: GENERIC; Manufacturer1 Part Number: NRC06F2002TRF; Power: 0.1W; TC: ±100ppm/°C; PressFit: No; Part Number: R0603_20K_1%_0.1W_100PPM; Component Kind: Standard; Component Type: Standard; Pin Count: 2; Value: 20k; Status: Preferred; Manufacturer Part Number: R0603_20K_1%_0.1W_100PPM; Case: 0603; Mounted: Yes; Sense: No; Socket: No; SMD: Yes; Manufacturer1 Example: NIC COMPONENT; Manufacturer1 ComponentHeight: 0.55mm; HelpURL: \\cern.ch\dfs\Applications\Altium\Datasheets\R0603_NIC_NRC.pdf; Author: CERN DEM JLC; CreateDate: 03.12.2007; LatestRevisionDate: 13.03.2008
R29 = R0603_2K4_1%_0.1W_100PPM: Resistor - 1%; Part Description: General Purpose Thick Film Chip Resistor; Manufacturer: GENERIC; Manufacturer1 Part Number: NRC06F2401TRF; Power: 0.1W; TC: ±100ppm/°C; PressFit: No; Part Number: R0603_2K4_1%_0.1W_100PPM; Component Kind: Standard; Component Type: Standard; Pin Count: 2; Value: 2k4; Status: Preferred; Manufacturer Part Number: R0603_2K4_1%_0.1W_100PPM; Case: 0603; Mounted: Yes; Sense: No; Socket: No; SMD: Yes; Manufacturer1 Example: NIC COMPONENT; Manufacturer1 ComponentHeight: 0.55mm; HelpURL: \\cern.ch\dfs\Applications\Altium\Datasheets\R0603_NIC_NRC.pdf; Author: CERN DEM JLC; CreateDate: 03.12.2007; LatestRevisionDate: 13.03.2008
R30 = R0603_3K_1%_0.33W_100PPM_VISHAY_CRCW-HP e3: Resistor - 1%; Part Description: Pulse Proof, High Power Thick Film Chip Resistor; Manufacturer: VISHAY DRALORIC; Manufacturer Part Number: CRCW06033K00FKEAHP; Power: 0.33W; TC: ±100ppm/°C; Voltage: 75V; PressFit: No; Part Number: R0603_3K_1%_0.33W_100PPM_VISHAY_CRCW-HP e3; Component Kind: Standard; Component Type: Standard; Pin Count: 2; Value: 3k; Status: None; Case: 0603; Mounted: Yes; Sense: No; Socket: No; SMD: Yes; ComponentHeight: 0.55mm; HelpURL: \\cern.ch\dfs\Applications\Altium\Datasheets\R0603_VISHAY_CRCW-HP e3.pdf; Author: CERN DEM BC; CreateDate: 01.03.2021; LatestRevisionDate: 01.03.2021
R31 = R0603_7K5_1%_0.1W_100PPM: Resistor - 1%; Part Description: General Purpose Thick Film Chip Resistor; Manufacturer: GENERIC; Manufacturer1 Part Number: NRC06F7501TRF; Power: 0.1W; TC: ±100ppm/°C; PressFit: No; Part Number: R0603_7K5_1%_0.1W_100PPM; Component Kind: Standard; Component Type: Standard; Pin Count: 2; Value: 7k5; Status: Preferred; Manufacturer Part Number: R0603_7K5_1%_0.1W_100PPM; Case: 0603; Mounted: Yes; Sense: No; Socket: No; SMD: Yes; Manufacturer1 Example: NIC COMPONENT; Manufacturer1 ComponentHeight: 0.55mm; HelpURL: \\cern.ch\dfs\Applications\Altium\Datasheets\R0603_NIC_NRC.pdf; Author: CERN DEM JLC; CreateDate: 03.12.2007; LatestRevisionDate: 13.03.2008
R33 R38 R39 R43 = R0603_200K_1%_0.1W_100PPM: Resistor - 1%; Part Description: General Purpose Thick Film Chip Resistor; Manufacturer: GENERIC; Manufacturer1 Part Number: NRC06F2003TRF; Power: 0.1W; TC: ±100ppm/°C; PressFit: No; Part Number: R0603_200K_1%_0.1W_100PPM; Component Kind: Standard; Component Type: Standard; Pin Count: 2; Value: 200k; Status: Preferred; Manufacturer Part Number: R0603_200K_1%_0.1W_100PPM; Case: 0603; Mounted: Yes; Sense: No; Socket: No; SMD: Yes; Manufacturer1 Example: NIC COMPONENT; Manufacturer1 ComponentHeight: 0.55mm; HelpURL: \\cern.ch\dfs\Applications\Altium\Datasheets\R0603_NIC_NRC.pdf; Author: CERN DEM JLC; CreateDate: 03.12.2007; LatestRevisionDate: 13.03.2008
S1 S2 = WA-SMSI,  9774140360: WA-SMSI SMD Steel Spacer with internal Thread; Manufacturer: Wurth Elektronik; partNo: 9774140360; ComponentLink1Description: Manufacturer; ComponentLink1URL: http://www.we-online.de; Created by: Baojun Chen; Created Date: 20.Oct.2015; ComponentLink2Description: Datasheet; ComponentLink2URL: http://katalog.we-online.de/em/datasheet/9774140360.pdf
T1 T2 = BSS138LT1G: N-CHANNEL MOSFET WITH DIODE; Part Description: 50V, 200mA N-Channel Enhancement Mode Field-Effect Transistor; Manufacturer: ON SEMICONDUCTOR; PressFit: No; Bonding: No; Part Number: BSS138LT1G; Component Kind: Standard; Component Type: Standard; Device: BSS138LT1G; PackageDescription: SOT23, 0.95mm Pitch; 3 Pin, 1.40mm W X 3.00mm L X 1.10mm H body, IPC Medium Density; Manufacturer Part Number: BSS138LT1G; Pin Count: 3; Case: SOT23-3; Mounted: Yes; Socket: No; SMD: Yes; Sense: No; ComponentHeight: 1.11mm; HelpURL: \\cern.ch\dfs\Applications\Altium\Datasheets\BSS138LT1G.pdf; Author: CERN DEM JLC; CreateDate: 23.03.2009; LatestRevisionDate: 23.03.2009
W1-W7 W9 W10 W12-W19 = SAMTEC_HTSW-102-23-L-S: 2 Mini Wire-Wrap Contact Strip Header; Part Description: 2 Contacts, Pitch 2.54mm, Single Row  Through Mount Straight Header (Post Lead 5.84mm, Tail Lead 2.92mm, Insulator 2.54mm); Manufacturer: SAMTEC; PressFit: No; Status Comment: High Temperature; Part Number: SAMTEC_HTSW-102-23-L-S; Component Kind: Standard; Component Type: Standard; Pin Count: 2; Family: Header 2; Mounted: Yes; Socket: No; SMD: No; Sense: No; Status: Preferred; Manufacturer Part Number: HTSW-102-23-L-S; ComponentHeight: 8.38mm; HelpURL: \\cern.ch\dfs\Applications\Altium\Datasheets\SAMTEC_HTSW-102-23-L-S.pdf; Author: CERN DEM JLC; CreateDate: 22.02.2018; LatestRevisionDate: 22.02.2018
W8 W11 W20 = SAMTEC_HTSW-103-23-L-S: 3 Mini Wire-Wrap Contact Strip Header; Part Description: 3 Contacts, Pitch 2.54mm, Single Row Through Mount Straight Header (Post Lead 5.84mm, Tail Lead 2.92mm, Insulator 2.54mm); Manufacturer: SAMTEC; PressFit: No; Status Comment: High Temperature; Part Number: SAMTEC_HTSW-103-23-L-S; Component Kind: Standard; Component Type: Standard; Pin Count: 3; Family: Header 3; Mounted: Yes; Socket: No; SMD: No; Sense: No; Status: Preferred; Manufacturer Part Number: HTSW-103-23-L-S; ComponentHeight: 8.38mm; HelpURL: \\cern.ch\dfs\Applications\Altium\Datasheets\SAMTEC_HTSW-103-23-L-S.pdf; Author: CERN DEM JLC; CreateDate: 22.02.2018; LatestRevisionDate: 22.02.2018